# Altium schematic sheet SW6124+A+B+C+MCU+SEG.SchDoc
size A3; SheetNumber: 0; SheetTotal: 0
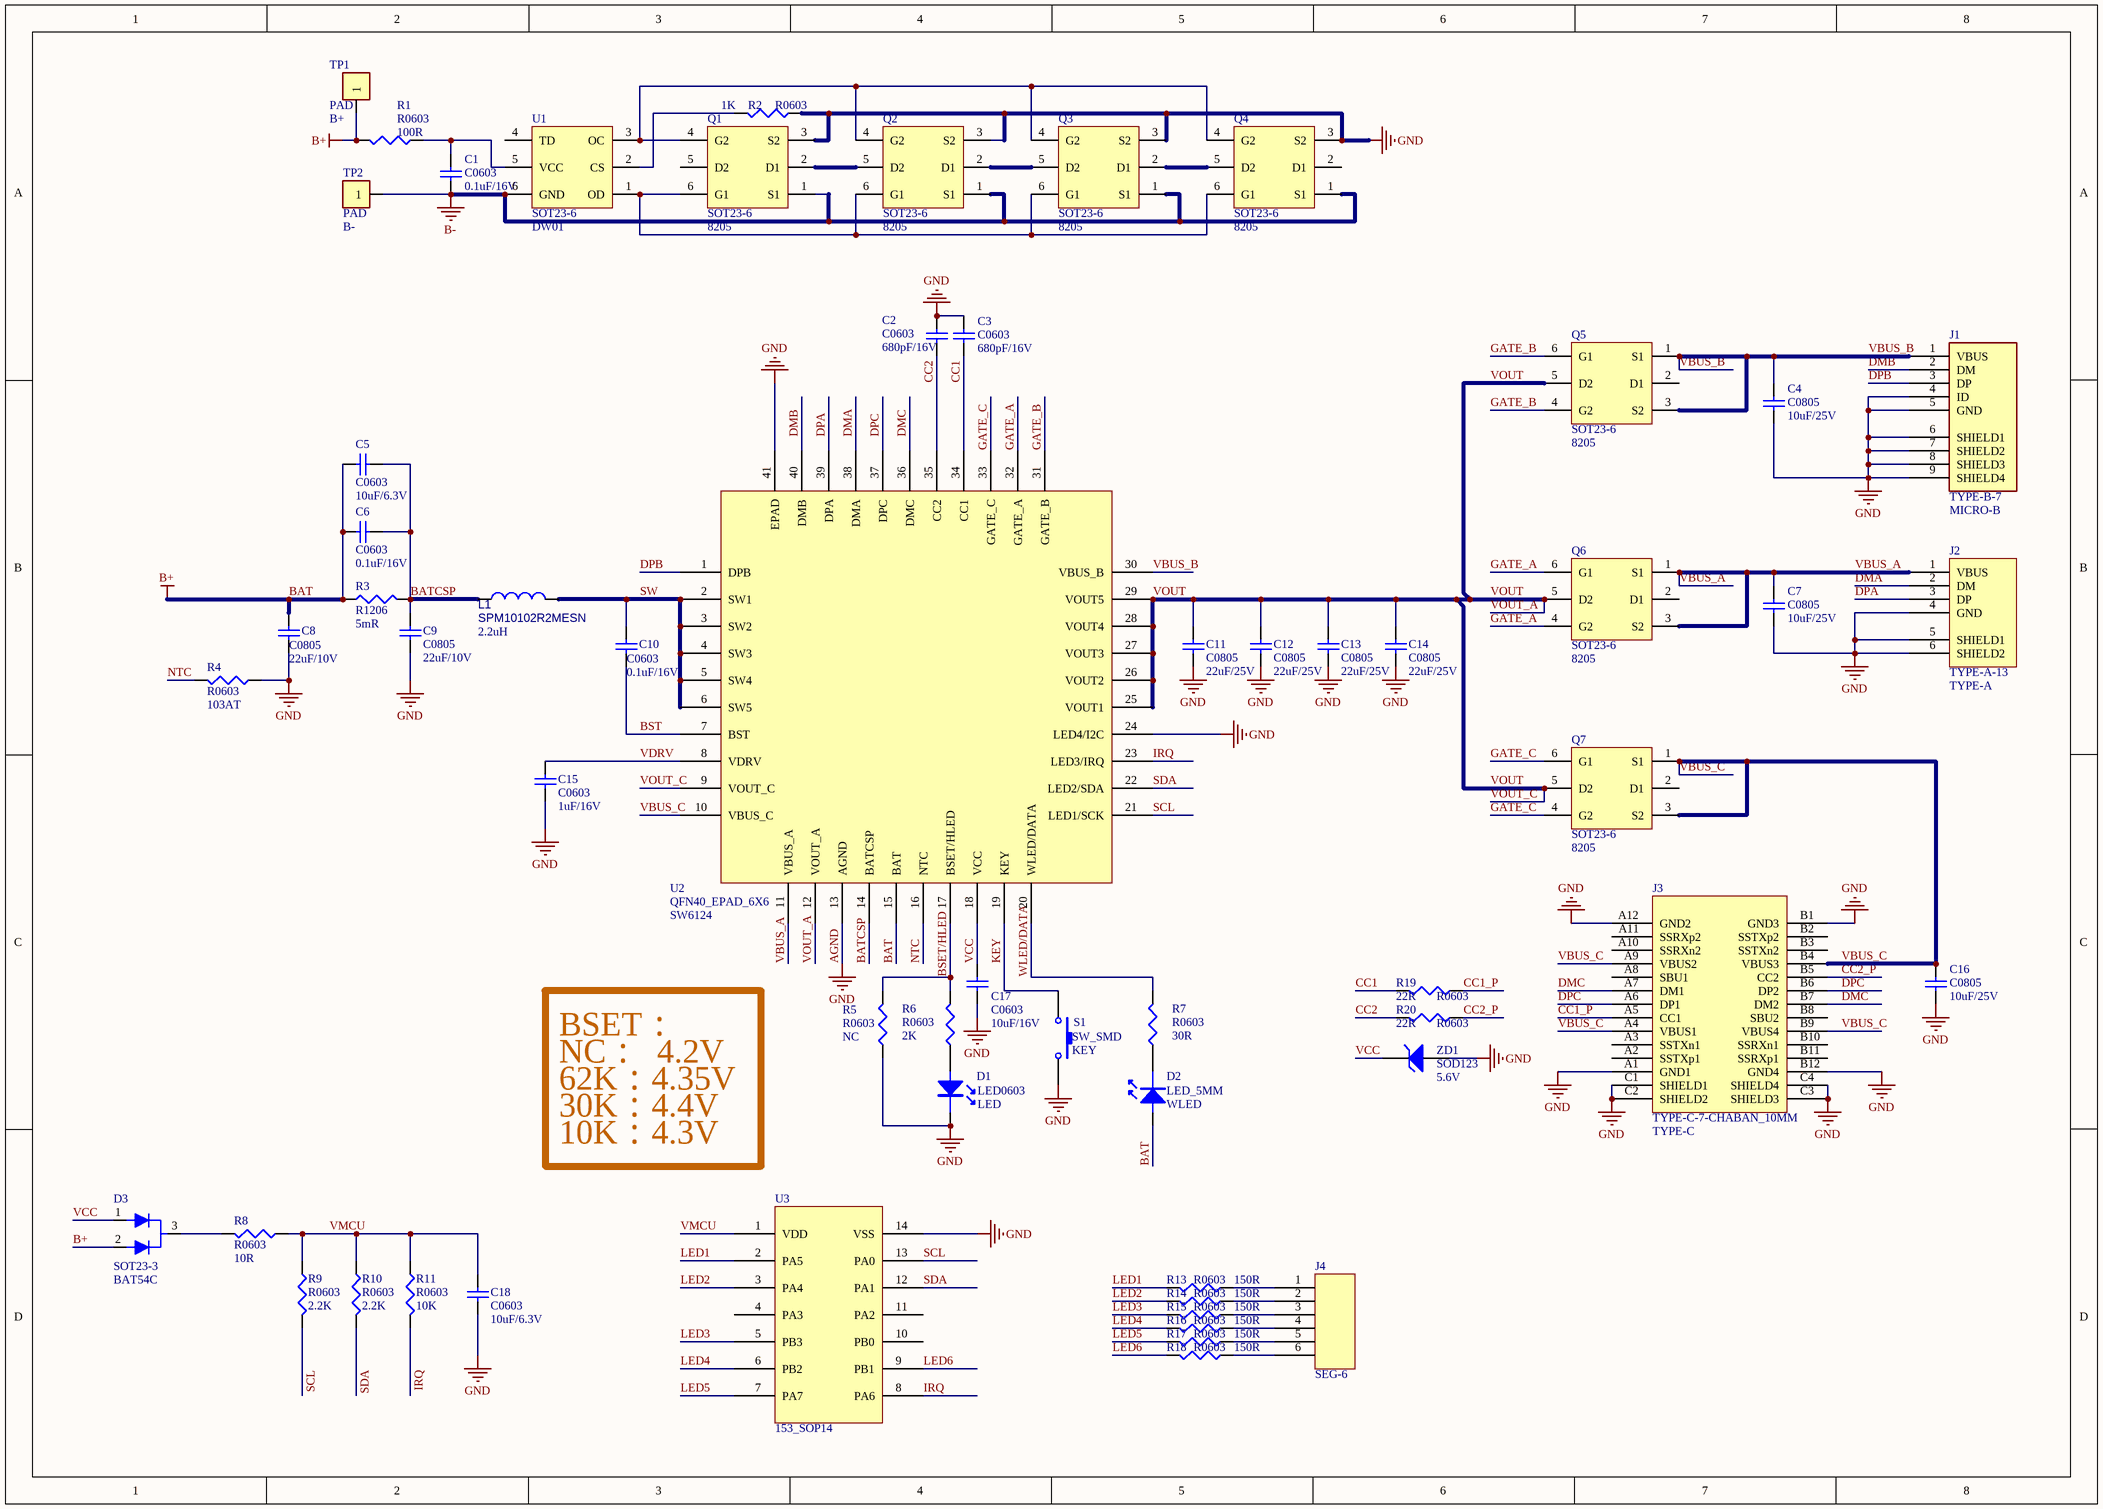
[diagram p0: SW6124+A+B+C+MCU+SEG.SchDoc]

## Parts
C1  C0603  value 0.1uF/16V  [C0603]
C2  C0603  value 680pF/16V  [C0603]
C3  C0603  value 680pF/16V  [C0603]
C4  C0805  value 10uF/25V  [C0805]
C5  C0603  value 10uF/6.3V  [C0603]
C6  C0603  value 0.1uF/16V  [C0603]
C7  C0805  value 10uF/25V  [C0805]
C8  C0805  value 22uF/10V  [C0805]
C9  C0805  value 22uF/10V  [C0805]
C10  C0603  value 0.1uF/16V  [C0603]
C11  C0805  value 22uF/25V  [C0805]
C12  C0805  value 22uF/25V  [C0805]
C13  C0805  value 22uF/25V  [C0805]
C14  C0805  value 22uF/25V  [C0805]
C15  C0603  value 1uF/16V  [C0603]
C16  C0805  value 10uF/25V  [C0805]
C17  C0603  value 10uF/16V  [C0603]
C18  C0603  value 10uF/6.3V  [C0603]
D1  LED  [LED0603]
D2  value WLED  [LED_5MM]  (hidden comment: LED_5MM)
D3  BAT54C  Footprint: SOT23-3  [SOT-23]
J1  value MICRO-B  [TYPE-B-7]  (hidden comment: USB_MICRO_B)
J2  value TYPE-A  [TYPE-A-13]  (hidden comment: TYPE-A-1)
J3  TYPE-C  [TYPE-C-7-CHABAN_10MM]
J4  SEG-6
L1  SPM10102R2MESN  value 2.2uH  [INDUCTOR_SPM1010]
Q1  8205  [SOT23-6]
Q2  8205  [SOT23-6]
Q3  8205  [SOT23-6]
Q4  8205  [SOT23-6]
Q5  8205  [SOT23-6]
Q6  8205  [SOT23-6]
Q7  8205  [SOT23-6]
R1  R0603  value 100R  [R0603]
R2  R0603  value 1K  [R0603]
R3  R1206  value 5mR  [R1206]
R4  R0603  value 103AT  [R0603]
R5  R0603  value NC  [R0603]
R6  R0603  value 2K  [R0603]
R7  R0603  value 30R  [R0603]
R8  R0603  value 10R  [R0603]
R9  R0603  value 2.2K  [R0603]
R10  R0603  value 2.2K  [R0603]
R11  R0603  value 10K  [R0603]
R13  R0603  value 150R  [R0603]
R14  R0603  value 150R  [R0603]
R15  R0603  value 150R  [R0603]
R16  R0603  value 150R  [R0603]
R17  R0603  value 150R  [R0603]
R18  R0603  value 150R  [R0603]
R19  R0603  value 22R  [R0603]
R20  R0603  value 22R  [R0603]
S1  KEY  [SW_SMD]
TP1  B+  [PAD]
TP2  B-  [PAD]
U1  DW01  [SOT23-6]
U2  Footprint: QFN40_EPAD_6X6  (hidden comment: SW6124)
U3  153_SOP14
ZD1  SOD123  [SOD-123]

## Nets
AGND: C2.2 C3.2 C4.1 C7.1 C8.1 C9.1 C11.1 C12.1 C13.1 C14.1 C15.1 C16.1 C17.1 C18.2 D1.2(K) J1.4(ID) J1.5(GND) J1.6(SHIELD1) J1.7(SHIELD2) J1.8(SHIELD3) J1.9(SHIELD4) J2.4(GND) J2.5(SHIELD1) J2.6(SHIELD2) J3.A1(GND1) J3.A12(GND2) J3.B1(GND3) J3.B12(GND4) J3.C1(SHIELD1) J3.C2(SHIELD2) J3.C3(SHIELD3) J3.C4(SHIELD4) Q1.3(S2) Q2.3(S2) Q3.3(S2) Q4.3(S2) R2.1 R4.1 R5.1 S1.2 U2.13(AGND) U2.24(LED4/I2C) U2.41(EPAD) U3.14(VSS) ZD1.1(A)  [also labelled GND]
B+: C5.1 C6.1 C8.2 D2.1(A) D3.2 R1.2 R3.1 TP1.1 U2.15(BAT)  [also labelled BAT]
B-: C1.1 Q1.1(S1) Q2.1(S1) Q3.1(S1) Q4.1(S1) TP2.1 U1.6(GND)
BATCSP: C5.2 C6.2 C9.2 L1.1 R3.2 U2.14(BATCSP)
BSET/HLED: R5.2 R6.2 U2.17(BSET/HLED)
BST: C10.1 U2.7(BST)
CC1: C3.1 R19.2 U2.34(CC1)
CC1_P: J3.A5(CC1) R19.1
CC2: C2.1 R20.2 U2.35(CC2)
CC2_P: J3.B5(CC2) R20.1
DMA: J2.2(DM) U2.38(DMA)
DMB: J1.2(DM) U2.40(DMB)
DMC: J3.A7(DM1) J3.B7(DM2) U2.36(DMC)
DPA: J2.3(DP) U2.39(DPA)
DPB: J1.3(DP) U2.1(DPB)
DPC: J3.A6(DP1) J3.B6(DP2) U2.37(DPC)
GATE_A: Q6.4(G2) Q6.6(G1) U2.32(GATE_A)
GATE_B: Q5.4(G2) Q5.6(G1) U2.31(GATE_B)
GATE_C: Q7.4(G2) Q7.6(G1) U2.33(GATE_C)
IRQ: R11.2 U2.23(LED3/IRQ) U3.8(PA6)
KEY: S1.1 U2.19(KEY)
LED1: R13.2 U3.2(PA5)
LED2: R14.2 U3.3(PA4)
LED3: R15.2 U3.5(PB3)
LED4: R16.2 U3.6(PB2)
LED5: R17.2 U3.7(PA7)
LED6: R18.2 U3.9(PB1)
NTC: R4.2 U2.16(NTC)
SCL: R9.2 U2.21(LED1/SCK) U3.13(PA0)
SDA: R10.2 U2.22(LED2/SDA) U3.12(PA1)
SW: C10.2 L1.2 U2.2(SW1) U2.3(SW2) U2.4(SW3) U2.5(SW4) U2.6(SW5)
VBUS_A: C7.2 J2.1(VBUS) Q6.1(S1) Q6.3(S2) U2.11(VBUS_A)
VBUS_B: C4.2 J1.1(VBUS) Q5.1(S1) Q5.3(S2) U2.30(VBUS_B)
VBUS_C: C16.2 J3.A4(VBUS1) J3.A9(VBUS2) J3.B4(VBUS3) J3.B9(VBUS4) Q7.1(S1) Q7.3(S2) U2.10(VBUS_C)
VCC: C17.2 D3.1 U2.18(VCC) ZD1.2(K)
VDRV: C15.2 U2.8(VDRV)
VMCU: C18.1 R8.1 R9.1 R10.1 R11.1 U3.1(VDD)
VOUT: C11.2 C12.2 C13.2 C14.2 Q5.5(D2) Q6.5(D2) Q7.5(D2) U2.9(VOUT_C) U2.12(VOUT_A) U2.25(VOUT1) U2.26(VOUT2) U2.27(VOUT3) U2.28(VOUT4) U2.29(VOUT5)  [also labelled VOUT_A, VOUT_C]
WLED/DATA: R7.2 U2.20(WLED/DATA)
NetC1_2: C1.2 R1.1 U1.5(VCC)
NetD1_1: D1.1(A) R6.1
NetD2_2: D2.2(K) R7.1
NetD3_3: D3.3 R8.2
NetJ4_1: J4.1 R13.1
NetJ4_2: J4.2 R14.1
NetJ4_3: J4.3 R15.1
NetJ4_4: J4.4 R16.1
NetJ4_5: J4.5 R17.1
NetJ4_6: J4.6 R18.1
NetQ1_2: Q1.2(D1) Q2.5(D2)
NetQ1_4: Q1.4(G2) Q2.4(G2) Q3.4(G2) Q4.4(G2) U1.3(OC)
NetQ1_6: Q1.6(G1) Q2.6(G1) Q3.6(G1) Q4.6(G1) U1.1(OD)
NetQ2_2: Q2.2(D1) Q3.5(D2)
NetQ3_2: Q3.2(D1) Q4.5(D2)
NetR2_2: R2.2 U1.2(CS)

Not connected (* = marked no-connect by the designer): J3 A2(SSTXp1) A3(SSTXn1) A8(SBU1) A10(SSRXn2) A11(SSRXp2) B2(SSTXp2) B3(SSTXn2) B8(SBU2) B10(SSRXn1) B11(SSRXp1); Q1 5(D2); Q4 2(D1); Q5 2(D1); Q6 2(D1); Q7 2(D1); U1 4(TD); U3 4(PA3) 10(PB0) 11(PA2)

## Notes on the sheet
- BSET：
- NC：  4.2V
- 62K：4.35V
- 30K：4.4V
- 10K：4.3V
- (in symbol D Zener) 5.6V

## Library data of the parts
C1 = Cap: Capacitor; Published: 8-Jun-2000; LatestRevisionDate: 17-Jul-2002; LatestRevisionNote: Re-released for DXP Platform.; PackageReference: RAD-0.3; Publisher: Altium Limited; PackageDescription: Radial Cap, Thru-Hole; 2 Leads; 0.3 in Pin Spacing
C2-C7 C10 C15-C18 = CAP0603: Capacitor; Published: 8-Jun-2000; LatestRevisionDate: 17-Jul-2002; LatestRevisionNote: Re-released for DXP Platform.; PackageReference: RAD-0.3; Publisher: Altium Limited; PackageDescription: Radial Cap, Thru-Hole; 2 Leads; 0.3 in Pin Spacing
C8 C9 C11-C14 = CAP0805: Capacitor; Published: 8-Jun-2000; LatestRevisionDate: 17-Jul-2002; LatestRevisionNote: Re-released for DXP Platform.; PackageReference: RAD-0.3; Publisher: Altium Limited; PackageDescription: Radial Cap, Thru-Hole; 2 Leads; 0.3 in Pin Spacing
D1 = LED: 单?: 0.1; Value: LED
D2 = LED: Footprinf: LED_5MM
D3 = D3
J4 = LCD-6
L1 = INDUCTOR
Q1-Q7 = 8205B: Value: 8205; Footprinf: SOT23-6
R1 R2 = Res3: Resistor; Published: 8-Jun-2000; LatestRevisionDate: 29-May-2009; LatestRevisionNote: IPC-7351 Footprint Added.; PackageReference: J1-0603; Publisher: Altium Limited; PackageDescription: Chip Resistor
R3-R11 R13-R20 = RES: Resistor; Published: 8-Jun-2000; LatestRevisionDate: 29-May-2009; LatestRevisionNote: IPC-7351 Footprint Added.; PackageReference: J1-0603; Publisher: Altium Limited; PackageDescription: Chip Resistor
S1 = SW K: Value: KEY; Footprinf: SW_SMD
TP1 TP2 = Test Point
  TP1: Value: B+
  TP2: Value: B-
U2 = SW6106_AFC: Value: SW6124
ZD1 = D Zener: Zener Diode
J1 = USB_MICRO_B: Footprintf: TYPE-B-7
J2 = TYPE-A-1: Footprinf: TYPE-A-13
J3 = TYPE-C: Value: TYPE-C
U1 = DW01: Value: DW01; Footprinf: SOT23-6